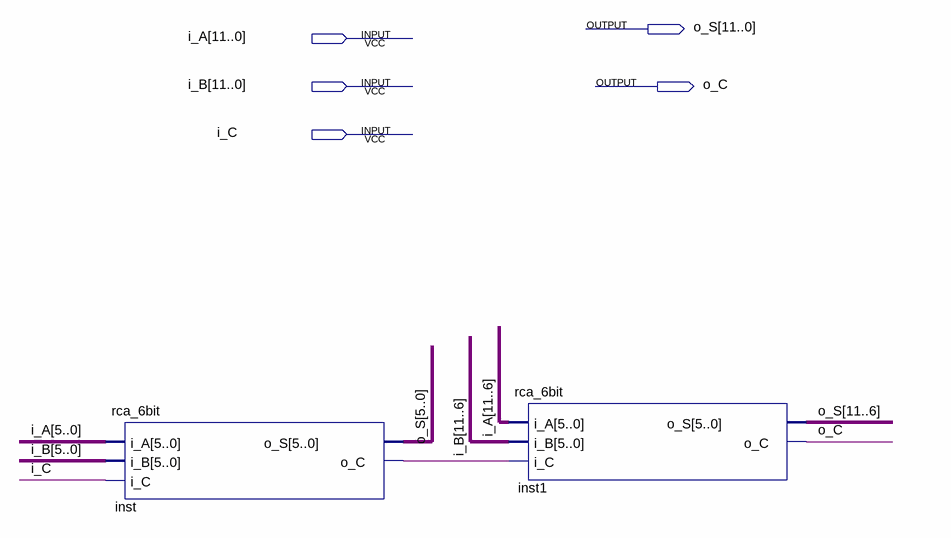
[diagram p0: schematic sheet]
// Quartus schematic rca_12bit.bdf as structural Verilog: 2 symbols, 5 pins
module rca_12bit (
  input  [11:0] i_A,
  input  [11:0] i_B,
  input  i_C,
  output [11:0] o_S,
  output o_C
);

  wire inst_o_c;

  rca_6bit inst (.i_A(i_A[5:0]), .i_B(i_B[5:0]), .i_C(i_C), .o_S(o_S[5:0]), .o_C(inst_o_c));
  rca_6bit inst1 (.i_A(i_A[11:6]), .i_B(i_B[11:6]), .i_C(inst_o_c), .o_S(o_S[11:6]), .o_C(o_C));
endmodule
